# Altium schematic sheet 继电器.SchDoc
size A4
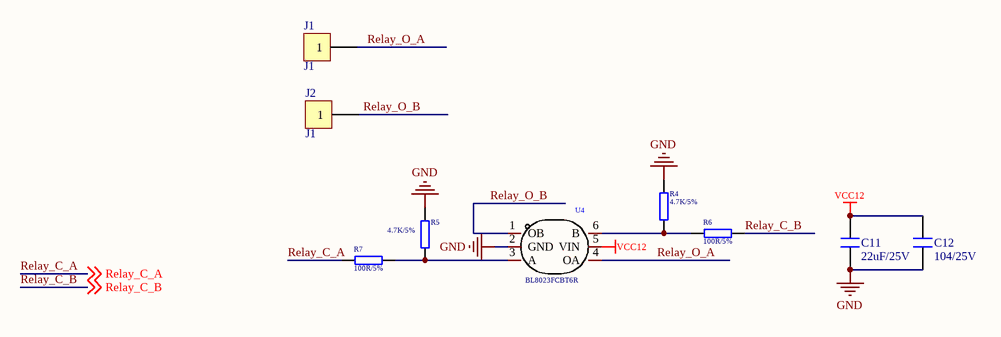
[diagram p0: 继电器.SchDoc]

## Parts
C11  22uF/25V  [0603R]
C12  104/25V  [0603R]
J1  J1  [贴片焊盘V1（3*2椭圆）]
J2  J1  [贴片焊盘V1（3*2椭圆）]
R4  4.7K/5%  [0603R]
R5  4.7K/5%  [0603R]
R6  100R/5%  [0603R]
R7  100R/5%  [0603R]
U4  BL8023FCBT6R  [SOT-23-6]

## Nets
GND: C11.1 C12.1 R4.1 R5.1 U4.2(GND)
VCC12: C11.2 C12.2 U4.5(VIN)
Relay_C_A: R7.2 ; off-sheet Relay_C_A
Relay_C_B: R6.1 ; off-sheet Relay_C_B
Relay_O_A: J1.1 U4.4(OA)
Relay_O_B: J2.1 U4.1(OB)
NetR4_2: R4.2 R6.2 U4.6(B)
NetR5_2: R5.2 R7.1 U4.3(A)

## Library data of the parts
C11 C12 = CAP_1
R4-R7 = RES
U4 = BL8023HCB6TR: Manufacturer: BL(上海贝岭); Add into BOM: yes; Symbol: BL8023HCB6TR; Device: BL8023HCB6TR; Supplier: LCSC; Supplier Part: C431145; Manufacturer Part: BL8023HCB6TR; JLCPCB Part Class: Extended Part; LCSC Part Name: BL8023HCB6TR 继电器驱动芯片 停产; Supplier Footprint: SOT-23-6; Datasheet: https://atta.szlcsc.com/upload/public/pdf/source/20190920/C431145_DEC39E836DB2A2F1462A8BB350F12ABB.pdf; Convert to PCB: yes